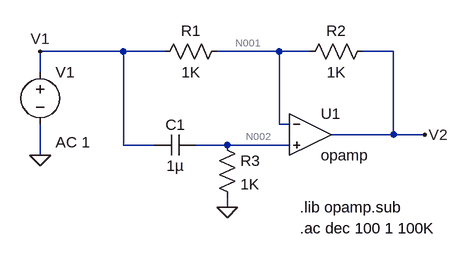
[diagram p0: schematic TPS1.asc]
TPS1.asc, the LTspice schematic file:
Version 4
SHEET 1 880 680
WIRE 0 64 -128 64
WIRE 64 64 0 64
WIRE 240 64 144 64
WIRE 288 64 240 64
WIRE 416 64 368 64
WIRE -128 96 -128 64
WIRE 240 176 240 64
WIRE 256 176 240 176
WIRE 416 192 416 64
WIRE 416 192 320 192
WIRE 464 192 416 192
WIRE 0 208 0 64
WIRE 48 208 0 208
WIRE 160 208 112 208
WIRE 256 208 160 208
WIRE -128 224 -128 176
WIRE 160 304 160 288
FLAG 160 304 0
FLAG 464 192 V2
FLAG -128 224 0
FLAG -128 64 V1
SYMBOL res 160 48 R90
WINDOW 0 0 56 VBottom 2
WINDOW 3 32 56 VTop 2
SYMATTR InstName R1
SYMATTR Value 1K
SYMBOL res 384 48 R90
WINDOW 0 0 56 VBottom 2
WINDOW 3 32 56 VTop 2
SYMATTR InstName R2
SYMATTR Value 1K
SYMBOL cap 112 192 R90
WINDOW 0 0 32 VBottom 2
WINDOW 3 32 32 VTop 2
SYMATTR InstName C1
SYMATTR Value 1µ
SYMBOL res 144 192 R0
SYMATTR InstName R3
SYMATTR Value 1K
SYMBOL voltage -128 80 R0
WINDOW 123 24 124 Left 2
WINDOW 39 0 0 Left 0
WINDOW 3 24 152 Left 2
SYMATTR Value2 AC 1
SYMATTR InstName V1
SYMATTR Value ""
SYMBOL OpAmps\\opamp 288 128 R0
SYMATTR InstName U1
TEXT 272 336 Left 2 !.ac dec 100 1 100K
TEXT 272 304 Left 2 !.lib opamp.sub

The netlist it stands for:
* TPS1.asc
R1 N001 V1 1K
R2 V2 N001 1K
C1 N002 V1 1µ
R3 N002 0 1K
V1 V1 0 AC 1
XU1 N001 N002 V2 opamp Aol=100K GBW=10Meg  ; pins invin noninvin out
.ac dec 100 1 100K
.lib opamp.sub
.backanno
.end

* Results of the author's LTspice run, read from the files saved beside the schematic
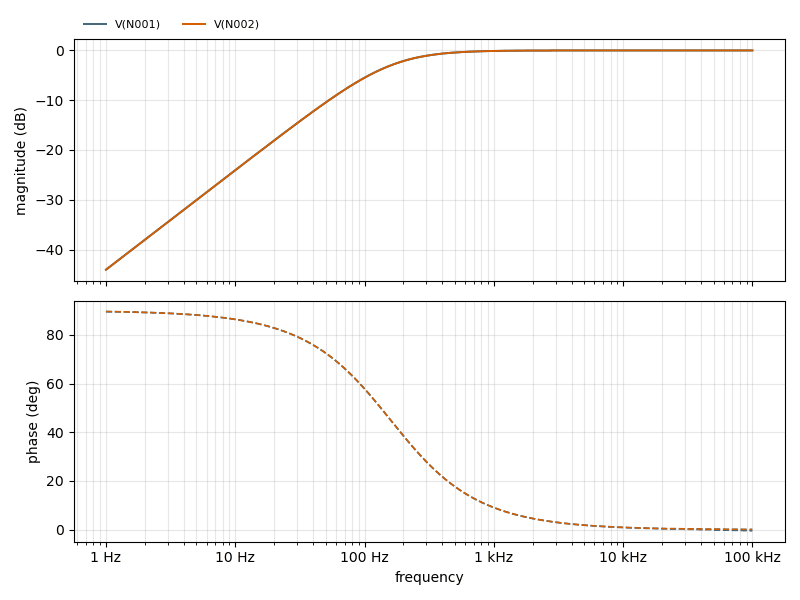
[diagram p1: AC Analysis of TPS1.asc, plotted from the saved traces]
* AC Analysis, 1 run:
*   V(N001): -44.04 dB at 1 Hz, -0.00 dB at 100 kHz, peak -0.00 dB at 30.2 kHz, 3 dB below the peak at 159.2 Hz
*   V(N002): -44.04 dB at 1 Hz, -0.00 dB at 100 kHz, peak -0.00 dB at 100 kHz, 3 dB below the peak at 159.2 Hz